# Altium project watch_V2.4.PrjPcb
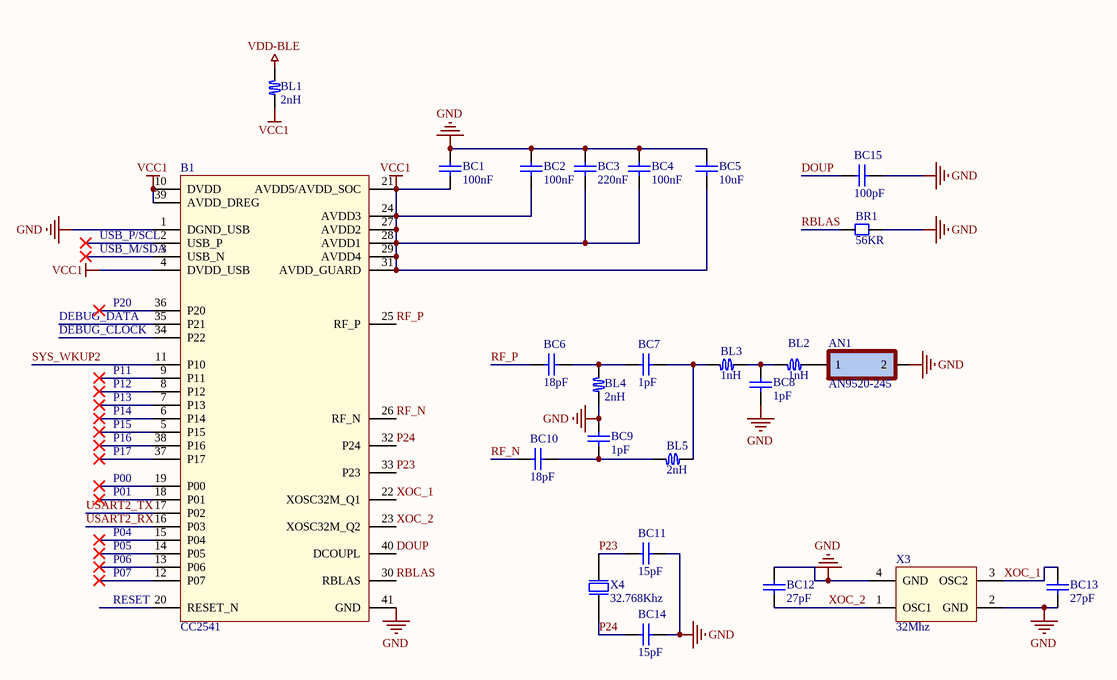
[diagram p0: 02-bluetooth-V2.4.SchDoc]
3 sheets, 83 parts. Net scope: global (net labels, ports and power ports of the same name join across sheets).
Board file: PCB-watch-V2.4.PcbDoc
Sheets:
  02-bluetooth-V2.4.SchDoc
  03-PeripheralPart-V2.4.SchDoc
  04-POWERV2.4.SchDoc

## Sheet 02-bluetooth-V2.4.SchDoc
size A4; Organization: Protel International P/L; Address1: L3, 12a Rodborough Rd; Address2: Frenchs Forest; Address3: NSW; Address4: Australia 2086

### Parts
AN1  AN9520-245  [AN-5120]
B1  CC2541  [QFN40-CC254X]
BC1  100nF  [CC1005-0402]
BC2  100nF  [CC1005-0402]
BC3  220nF  [CC1005-0402]
BC4  100nF  [CC1005-0402]
BC5  10uF  [CC1005-0402]
BC6  18pF  [CC1005-0402]
BC7  1pF  [CC1005-0402]
BC8  1pF  [CC1005-0402]
BC9  1pF  [CC1005-0402]
BC10  18pF  [CC1005-0402]
BC11  15pF  [CC1005-0402]
BC12  27pF  [CC1005-0402]
BC13  27pF  [CC1005-0402]
BC14  15pF  [CC1005-0402]
BC15  100pF  [CC1005-0402]
BL1  2nH  [Inductor-0402]
BL2  1nH  [Inductor-0402]
BL3  1nH  [Inductor-0402]
BL4  2nH  [Inductor-0402]
BL5  2nH  [Inductor-0402]
BR1  56KR  [CR1005-0402]
X3  32Mhz  [XTAL-2016]
X4  32.768Khz  [XTAL-2012]

### Nets
GND: AN1.2 B1.1(DGND_USB) B1.41(GND) BC1.2 BC2.2 BC3.2 BC4.2 BC5.2 BC8.1 BC9.1 BC11.2 BC12.2 BC13.1 BC14.2 BC15.1 BL4.1 BR1.2 X3.2(GND) X3.4(GND)
VCC1: B1.4(DVDD_USB) B1.10(DVDD) B1.21(AVDD5/AVDD_SOC) B1.24(AVDD3) B1.27(AVDD2) B1.28(AVDD1) B1.29(AVDD4) B1.31(AVDD_GUARD) B1.39(AVDD_DREG) BC1.1 BC2.1 BC3.1 BC4.1 BC5.1 BL1.1
VDD-BLE: BL1.2
DEBUG_CLOCK: B1.34(P22)
DEBUG_DATA: B1.35(P21)
DOUP: B1.40(DCOUPL) BC15.2
P00: B1.19(P00)
P01: B1.18(P01)
P04: B1.15(P04)
P05: B1.14(P05)
P06: B1.13(P06)
P07: B1.12(P07)
P11: B1.9(P11)
P12: B1.8(P12)
P13: B1.7(P13)
P14: B1.6(P14)
P15: B1.5(P15)
P16: B1.38(P16)
P17: B1.37(P17)
P20: B1.36(P20)
P23: B1.33(P23) BC11.1 X4.2
P24: B1.32(P24) BC14.1 X4.1
RBLAS: B1.30(RBLAS) BR1.1
RESET: B1.20(RESET_N)
RF_N: B1.26(RF_N) BC10.2
RF_P: B1.25(RF_P) BC6.2
SYS_WKUP2: B1.11(P10)
USART2_RX: B1.16(P03)
USART2_TX: B1.17(P02)
USB_M/SDA: B1.3(USB_N)
USB_P/SCL: B1.2(USB_P)
XOC_1: B1.22(XOSC32M_Q1) BC13.2 X3.3(OSC2)
XOC_2: B1.23(XOSC32M_Q2) BC12.1 X3.1(OSC1)
NetAN1_1: AN1.1 BL2.1
NetBC6_1: BC6.1 BC7.1 BL4.2
NetBC7_2: BC7.2 BL3.2 BL5.1
NetBC8_2: BC8.2 BL2.2 BL3.1
NetBC9_2: BC9.2 BC10.1 BL5.2

### Notes on the sheet
- Title
- Size:
- Date:
- A4
- Number:
- Time:
- Revision:
- Sheet
- of
- File:

### Library data of the parts
AN1 = AN9520-245: 2.4G全向天线 蓝牙天线 陶瓷贴片 WIFI内置
B1 = CC2541: 低功耗蓝牙芯片
BC1-BC15 = Chip capacitor: 贴片电容
BL1-BL5 = Inductor-0402: 0402封装的电感
BR1 = Chip resistor: 贴片电阻
X3 = XTAL 2016: 2016封装的晶振
X4 = XTAL 2012: 2012封装的时钟晶振

## Sheet 03-PeripheralPart-V2.4.SchDoc
size A4
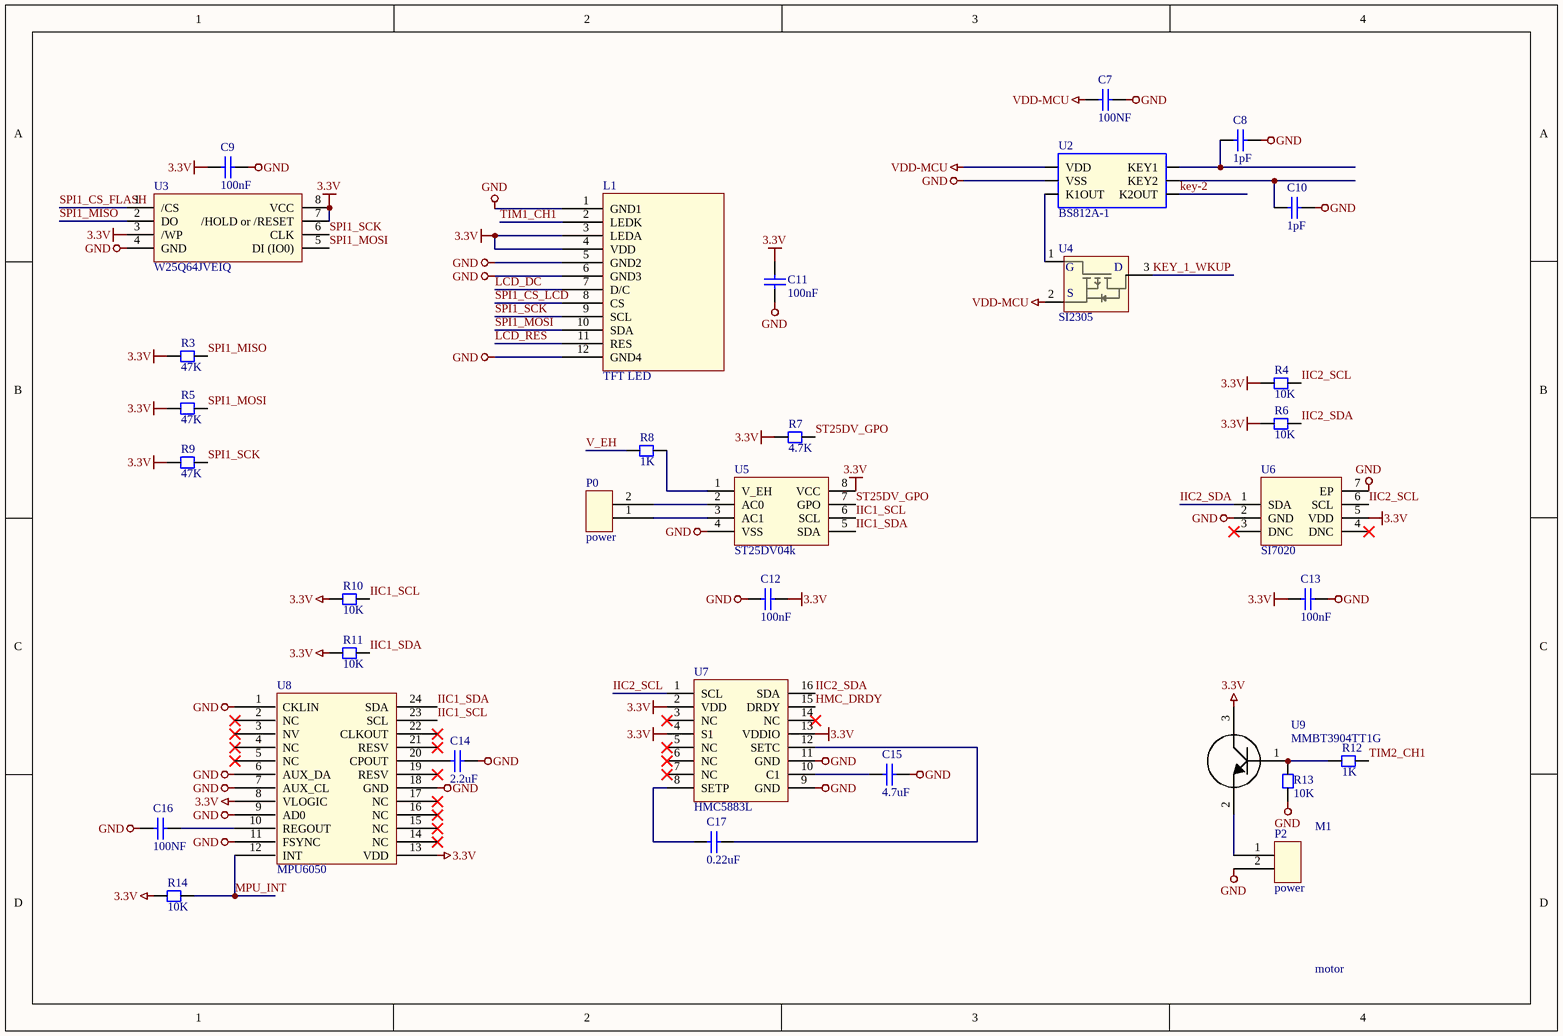
[diagram p1: 03-PeripheralPart-V2.4.SchDoc]

### Parts
C7  100NF  [CC1005-0402]
C8  1pF  [CC1005-0402]
C9  100nF  [CC1005-0402]
C10  1pF  [CC1005-0402]
C11  100nF  [CC1005-0402]
C12  100nF  [CC1005-0402]
C13  100nF  [CC1005-0402]
C14  2.2uF  [CC1005-0402]
C15  4.7uF  [CC1005-0402]
C16  100NF  [CC1005-0402]
C17  0.22uF  [CC1005-0402]
L1  TFT LED  [LCD-1.3-(2)]
M1  motor  [motor]
P0  power  [POWER2]
P2  power  [POWER-3.7V]
R3  47K  [CR1005-0402]
R4  10K  [CR1005-0402]
R5  47K  [CR1005-0402]
R6  10K  [CR1005-0402]
R7  4.7K  [CR1005-0402]
R8  1K  [CR1005-0402]
R9  47K  [CR1005-0402]
R10  10K  [CR1005-0402]
R11  10K  [CR1005-0402]
R12  1K  [CR1005-0402]
R13  10K  [CR1005-0402]
R14  10K  [CR1005-0402]
U2  BS812A-1  [SOT23-6]
U3  W25Q64JVEIQ  [WSON-8_L8.0-W6.10-P1.27-TL-EP]
U4  SI2305  [SOT-23]
U5  ST25DV04k  [UFDFPN8]
U6  SI7020  [DFN-6]
U7  HMC5883L  [LPCC-16_L3.0-W3.0-P0.50-BL]
U8  MPU6050  [QFN24 - duplicate]
U9  MMBT3904TT1G  [SOT-416]

### Nets
3.3V: C9.1 C11.1 C12.2 C13.1 L1.3(LEDA) L1.4(VDD) R3.2 R4.2 R5.2 R6.2 R7.1 R9.2 R10.2 R11.2 R14.2 U3.3(/WP) U3.7(/HOLD_or_/RESET) U3.8(VCC) U5.8(VCC) U6.5(VDD) U7.2(VDD) U7.4(S1) U7.13(VDDIO) U8.8(VLOGIC) U8.13(VDD) U9.3
GND: C7.1 C8.2 C9.2 C10.2 C11.2 C12.1 C13.2 C14.2 C15.2 C16.1 L1.1(GND1) L1.5(GND2) L1.6(GND3) L1.12(GND4) P2.2 R13.2 U2.2(VSS) U3.4(GND) U5.4(VSS) U6.2(GND) U6.7(EP) U7.9(GND) U7.11(GND) U8.1(CKLIN) U8.6(AUX_DA) U8.7(AUX_CL) U8.9(AD0) U8.11(FSYNC) U8.18(GND)
VDD-MCU: C7.2 U2.1(VDD) U4.2(SOURCE)
HMC_DRDY: U7.15(DRDY)
IIC1_SCL: R10.1 U5.6(SCL) U8.23(SCL)
IIC1_SDA: R11.1 U5.5(SDA) U8.24(SDA)
IIC2_SCL: R4.1 U6.6(SCL) U7.1(SCL)
IIC2_SDA: R6.1 U6.1(SDA) U7.16(SDA)
key-2: U2.4(K2OUT)
KEY_1_WKUP: U4.3(DRAIN)
LCD_DC: L1.7(D/C)
LCD_RES: L1.11(RES)
MPU_INT: R14.1 U8.12(INT)
SPI1_CS_FLASH: U3.1(/CS)
SPI1_CS_LCD: L1.8(CS)
SPI1_MISO: R3.1 U3.2(DO)
SPI1_MOSI: L1.10(SDA) R5.1 U3.5(DI_(IO0))
SPI1_SCK: L1.9(SCL) R9.1 U3.6(CLK)
ST25DV_GPO: R7.2 U5.7(GPO)
TIM1_CH1: L1.2(LEDK)
TIM2_CH1: R12.1
V_EH: R8.2
NetC8_1: C8.1 U2.6(KEY1)
NetC10_1: C10.1 U2.5(KEY2)
NetC14_1: C14.1 U8.20(CPOUT)
NetC15_1: C15.1 U7.10(C1)
NetC16_2: C16.2 U8.10(REGOUT)
NetC17_1: C17.1 U7.8(SETP)
NetC17_2: C17.2 U7.12(SETC)
NetP0_1: P0.1 U5.3(AC1)
NetP0_2: P0.2 U5.2(AC0)
NetP2_1: P2.1 U9.2
NetR8_1: R8.1 U5.1(V_EH)
NetR12_2: R12.2 R13.1 U9.1
NetU2_3: U2.3(K1OUT) U4.1(GATE)

Not connected (* = marked no-connect by the designer): U6 3(DNC)* 4(DNC)*; U7 3(NC)* 5(NC)* 6(NC)* 7(NC)* 14(NC)*; U8 2(NC)* 3(NV)* 4(NC)* 5(NC)* 14(NC)* 15(NC)* 16(NC)* 17(NC)* 19(RESV)* 21(RESV)* 22(CLKOUT)*

### Notes on the sheet
- (in symbol SI2305) G; D; S

### Library data of the parts
C7-C17 = Chip capacitor: 贴片电容
L1 = LCD-IPSscreen-1.3: 1.3寸显示屏幕
M1 = motor: 震动马达
R3-R14 = Chip resistor: 贴片电阻
U2 = BS812A-1: 触摸按键 两路 SOP23-6封装极简电路
U3 = W25Q256JVEIQ: FLASH
U4 = SI2305: PMOS场效应MOS管 SOT-23
U5 = ST25DV04k: NFC芯片4K存储空间
U6 = SI7020: 温湿度传感器芯片
U7 = HMC5883L: 三轴罗盘
U8 = MPU6050: 陀螺仪
U9 = MMBT3904TT1G: NPN 电流 - 集电极（Ic）（最大值）：200mA 电压 - 集射极击穿（最大值）：40V SOT-23-3

## Sheet 04-POWERV2.4.SchDoc
size A4
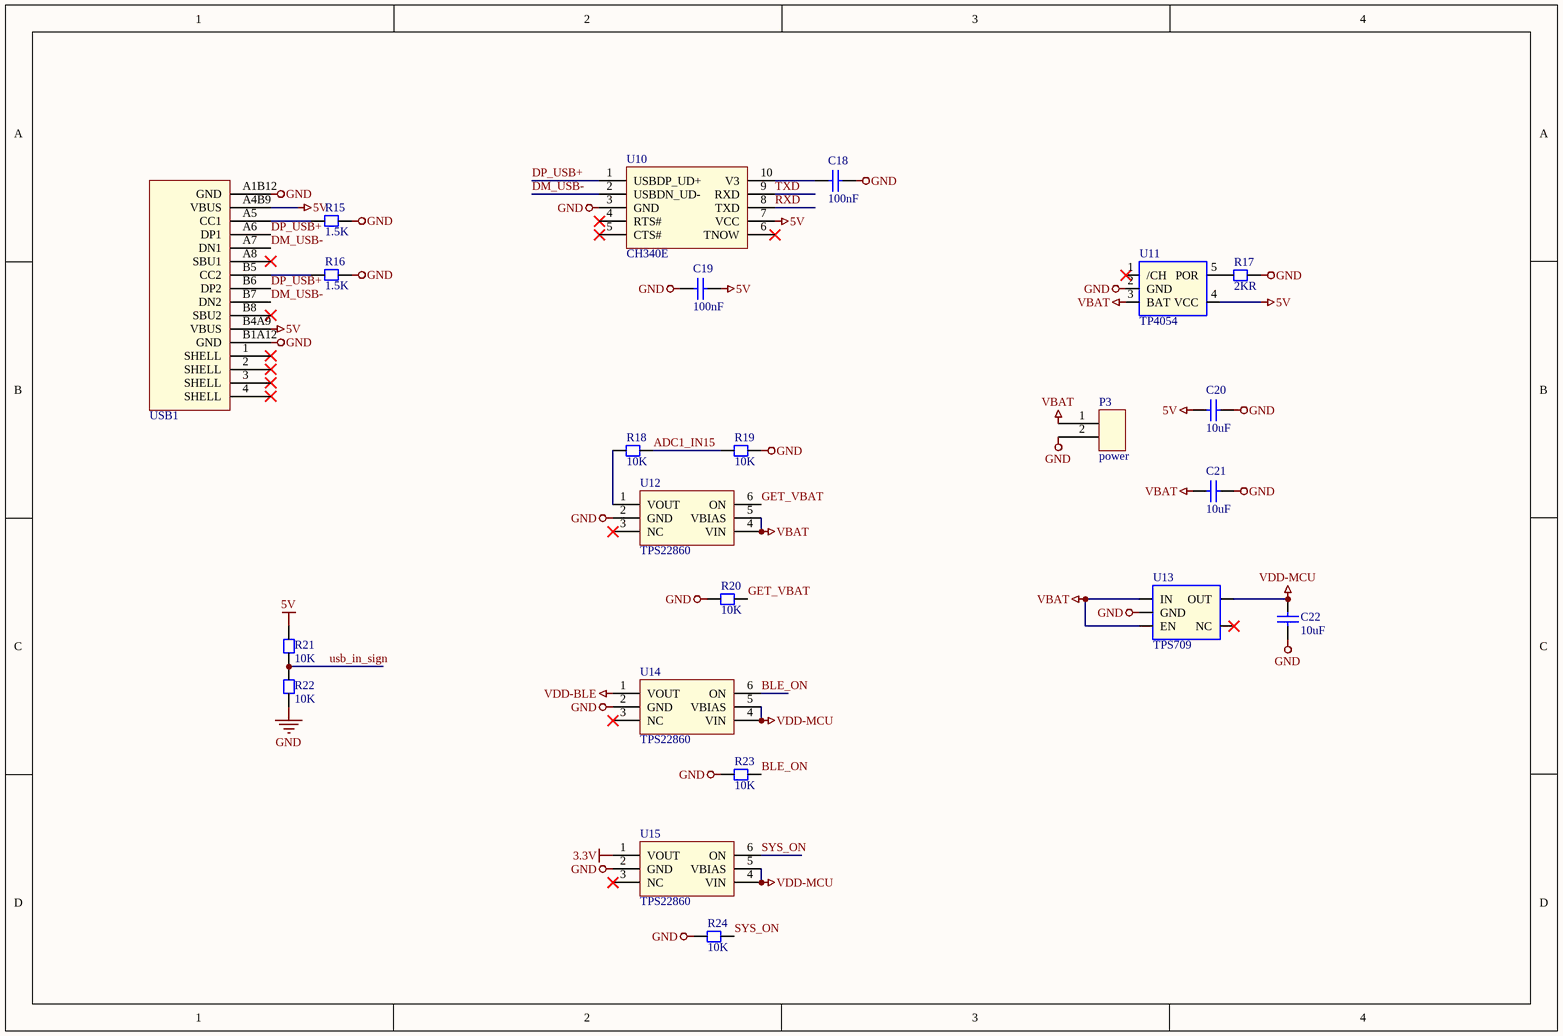
[diagram p2: 04-POWERV2.4.SchDoc]

### Parts
C18  100nF  [CC1005-0402]
C19  100nF  [CC1005-0402]
C20  10uF  [CC1005-0402]
C21  10uF  [CC1005-0402]
C22  10uF  [CC1005-0402]
P3  power  [POWER-3.7V]
R15  1.5K  [CR1005-0402]
R16  1.5K  [CR1005-0402]
R17  2KR  [CR1005-0402]
R18  10K  [CR1005-0402]
R19  10K  [CR1005-0402]
R20  10K  [CR1005-0402]
R21  10K  [CR1005-0402]
R22  10K  [CR1005-0402]
R23  10K  [CR1005-0402]
R24  10K  [CR1005-0402]
U10  CH340E  [MSOP-10]
U11  TP4054  [SOT23-5]
U12  TPS22860  [SOT23-6]
U13  TPS709  [SOT23-5]
U14  TPS22860  [SOT23-6]
U15  TPS22860  [SOT23-6]
USB1  Tpye-c 16P  [TYPE-C 16P]  (value not drawn)

### Nets
3.3V: U15.1(VOUT)
5V: C19.2 C20.2 R21.1 U10.7(VCC) U11.4(VCC) USB1.A4B9(VBUS) USB1.B4A9(VBUS)
GND: C18.2 C19.1 C20.1 C21.1 C22.2 P3.2 R15.1 R16.1 R17.1 R19.2 R20.1 R22.2 R23.1 R24.1 U10.3(GND) U11.2(GND) U12.2(GND) U13.2(GND) U14.2(GND) U15.2(GND) USB1.A1B12(GND) USB1.B1A12(GND)
VBAT: C21.2 P3.1 U11.3(BAT) U12.4(VIN) U12.5(VBIAS) U13.1(IN) U13.3(EN)
VDD-BLE: U14.1(VOUT)
VDD-MCU: C22.1 U13.5(OUT) U14.4(VIN) U14.5(VBIAS) U15.4(VIN) U15.5(VBIAS)
ADC1_IN15: R18.1 R19.1
BLE_ON: R23.2 U14.6(ON)
DM_USB-: U10.2(USBDN_UD-) USB1.A7(DN1) USB1.B7(DN2)
DP_USB+: U10.1(USBDP_UD+) USB1.A6(DP1) USB1.B6(DP2)
GET_VBAT: R20.2 U12.6(ON)
RXD: U10.8(TXD)
SYS_ON: R24.2 U15.6(ON)
TXD: U10.9(RXD)
usb_in_sign: R21.2 R22.1
NetC18_1: C18.1 U10.10(V3)
NetR15_2: R15.2 USB1.A5(CC1)
NetR16_2: R16.2 USB1.B5(CC2)
NetR17_2: R17.2 U11.5(POR)
NetR18_2: R18.2 U12.1(VOUT)

Not connected (* = marked no-connect by the designer): U10 4(RTS#)* 5(CTS#)* 6(TNOW)*; U11 1(/CH)*; U12 3(NC)*; U13 4(NC)*; U14 3(NC)*; U15 3(NC)*; USB1 1(SHELL)* 2(SHELL)* 3(SHELL)* 4(SHELL)* A8(SBU1)* B8(SBU2)*

### Library data of the parts
C18-C22 = Chip capacitor: 贴片电容
R15-R24 = Chip resistor: 贴片电阻
U10 = CH340E: usd转串口芯片 MSOP10封装
U11 = TP4054: 迷你充电IC SOT-23-5
U12 U14 U15 = TPS22860: 超低泄漏电流负载开关  超低泄漏电流负载开关 它可支持最大 200mA 的持续电 / 流。 此开关可由一个打开/关闭输入 (ON) 控制
U13 = TPS709: 3.3V降压IC SOT23-5封装 最大输出150ma电流
USB1 = Tpye-c 16P: 16P 封装的TYPE -c接口 4固定插脚 双向

## Nets that join several sheets
3.3V: 03-PeripheralPart-V2.4 (26 pins), 04-POWERV2.4 (U15.1)
GND: 02-bluetooth-V2.4 (19 pins), 03-PeripheralPart-V2.4 (29 pins), 04-POWERV2.4 (22 pins)
VDD-BLE: 02-bluetooth-V2.4 (BL1.2), 04-POWERV2.4 (U14.1)
VDD-MCU: 03-PeripheralPart-V2.4 (C7.2 U2.1 U4.2), 04-POWERV2.4 (6 pins)